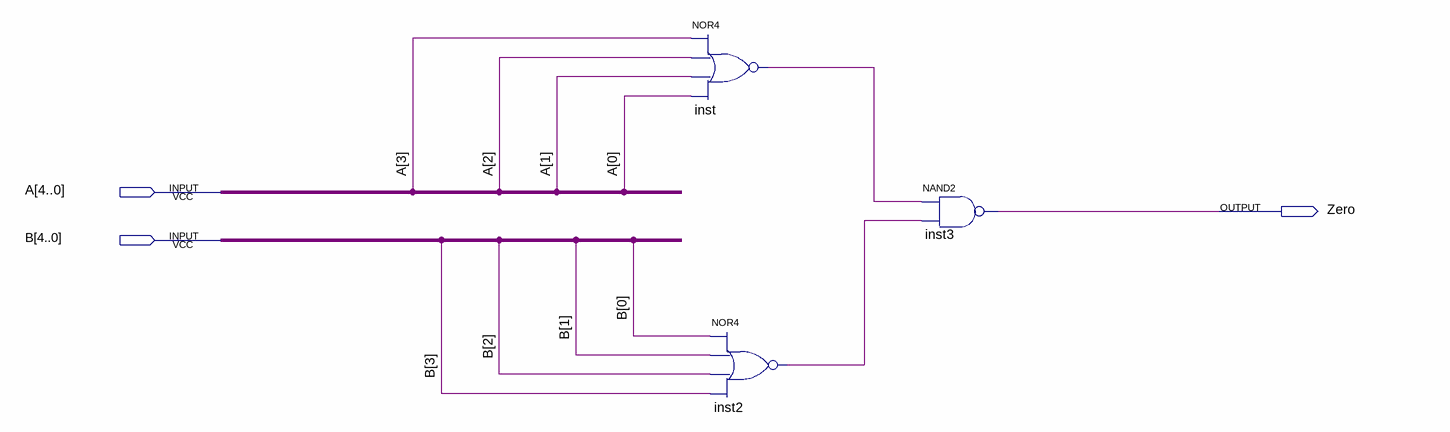
[diagram p0: schematic sheet]
// Quartus schematic Zero_Sin.bdf as structural Verilog: 3 symbols, 3 pins
module Zero_Sin (
  input  [4:0] A,
  input  [4:0] B,
  output Zero
);

  wire inst2_out, inst_out;

  nor inst (inst_out, A[3], A[2], A[1], A[0]);
  nor inst2 (inst2_out, B[0], B[1], B[2], B[3]);
  nand inst3 (Zero, inst_out, inst2_out);
endmodule
